# EAGLE design RGB (EAGLE 5.04)
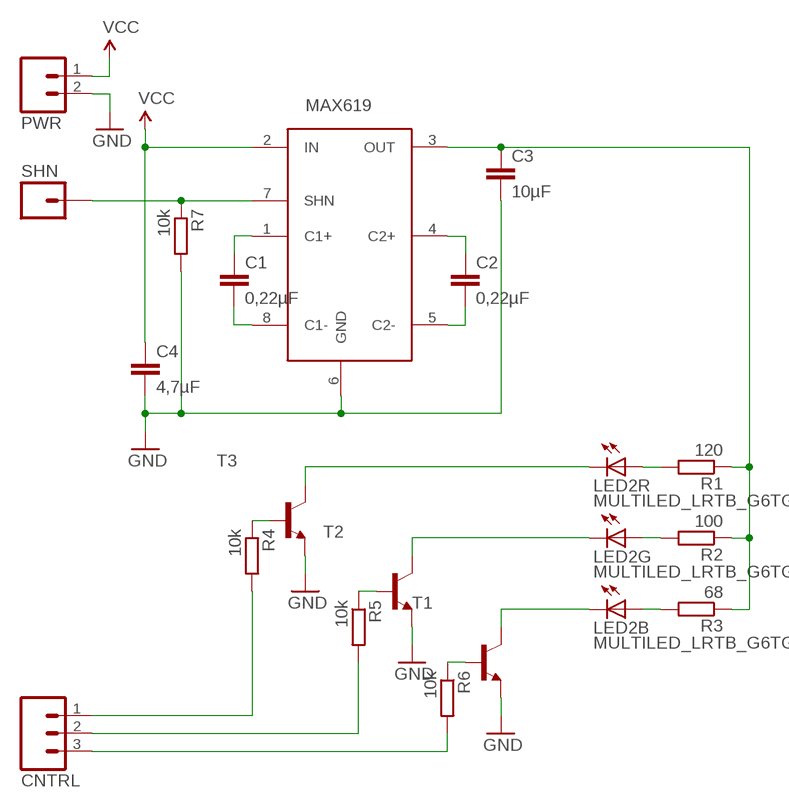
[diagram p0: schematic, sheet 1]

## Parts
C1  0,22µF  C-EUC0805  [C0805]
C2  0,22µF  C-EUC0805  [C0805]
C3  10µF  C-EUC0805  [C0805]
C4  4,7µF  C-EUC0805  [C0805]
CNTRL  M03PTH  [1X03]
IC1  MAX619SOIC8  [SO08]
LED2  MULTILED_LRTB_G6TG  [P-LCC-6_TOPLED]
PWR  M02PTH  [1X02]
R1  120  R-EU_M0805  [M0805]
R2  100  R-EU_M0805  [M0805]
R3  68  R-EU_M0805  [M0805]
R4  10k  R-EU_M0805  [M0805]
R5  10k  R-EU_M0805  [M0805]
R6  10k  R-EU_M0805  [M0805]
R7  10k  R-EU_M0805  [M0805]
SHN  M01PTH  [1X01]
T1  BC850-NPN-SOT23-BEC  [SOT23-BEC]
T2  BC850-NPN-SOT23-BEC  [SOT23-BEC]
T3  BC850-NPN-SOT23-BEC  [SOT23-BEC]

## Nets
GND: C3.2 C4.2 IC1.6(GND) PWR.2 R7.2 T1.E T2.E T3.E
N$1: LED2.C1(R:C) T3.C
N$2: C1.1 IC1.1(C1+)
N$3: C1.2 IC1.8(C1-)
N$4: C2.1 IC1.4(C2+)
N$5: C2.2 IC1.5(C2-)
N$6: LED2.A1(R:A) R1.2
N$7: C3.1 IC1.3(OUT) R1.1 R2.1 R3.1
N$8: LED2.A2(G:A) R2.2
N$9: LED2.C2(G:C) T2.C
N$10: LED2.A3(B:A) R3.2
N$11: LED2.C3(B:C) T1.C
N$12: R4.1 T3.B
N$13: R5.1 T2.B
N$14: R6.1 T1.B
N$15: CNTRL.1 R4.2
N$16: CNTRL.2 R5.2
N$17: CNTRL.3 R6.2
N$19: IC1.7(SHN) R7.1 SHN.1
VCC: C4.1 IC1.2(IN) PWR.1

## Library data of the parts
C1-C4 = rcl:C-EU: CAPACITOR, European symbol
CNTRL = SparkFun:M03: Header 3 Standard 3-pin 0.1" header. Use with straight break away headers (SKU : PRT-00116), right angle break away headers (PRT-00553), swiss pins (PRT-00743), machine pins (PRT-00117), and female headers (PRT-00115). Molex polarized connector foot print use with SKU : PRT-08232 with associated crimp pins and housings.
IC1 = maxim-10:MAX619
LED2 = led:MULTILED_LRTB_G6TG: 6-lead MULTILED® Enhanced optical Power LED (ThinFilm® / ThinGaN®) Source. OSRAM - LRTB_G6TG.pdf
PWR = SparkFun:M02: Header 2 Standard 2-pin 0.1" header. Use with straight break away headers (SKU : PRT-00116), right angle break away headers (PRT-00553), swiss pins (PRT-00743), machine pins (PRT-00117), and female headers (PRT-00115). Molex polarized connector foot print use with SKU : PRT-08233 with associated crimp pins and housings.
R1-R7 = rcl:R-EU_: RESISTOR, European symbol
SHN = SparkFun:M01: Header 1 Standard 1-pin 0.1" header. Use with straight break away headers (SKU : PRT-00116), right angle break away headers (PRT-00553), swiss pins (PRT-00743), machine pins (PRT-00117), and female headers (PRT-00115).
T1-T3 = transistor:*-NPN-: NPN Transistror BF959 corrected 2008.03.06

## Board
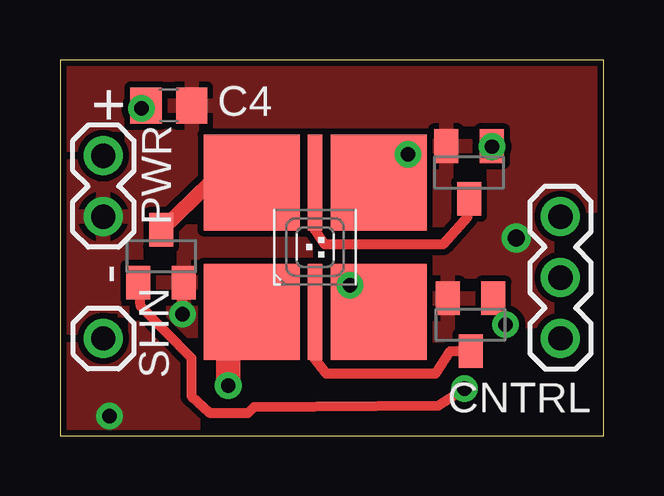
[diagram p1: board, top side]
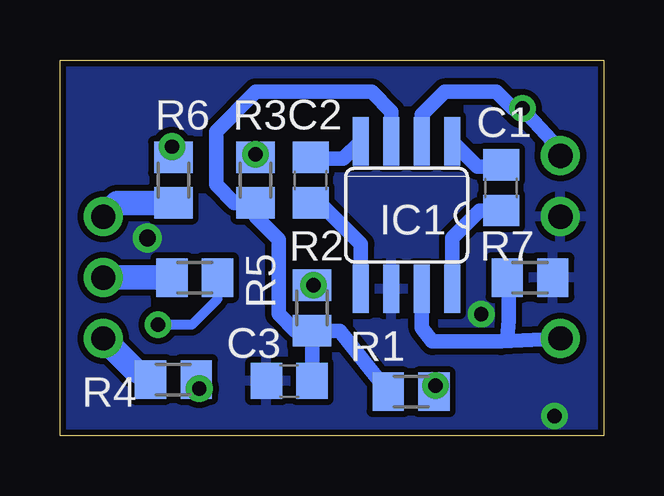
[diagram p2: board, bottom side, seen from below]

Size 22.66 x 15.67 mm. Coordinates in mm from the lower left corner, seen from the top.
Outline: 0,0 22.66,0 22.66,15.67 0,15.67 0,0
Copper layers (1*16): Top 0.035mm / dielectric 1.5mm / Bottom 0.035mm
Design rules "SparkFun.strict": minimum track width 10mil, minimum drill 20mil, track to track 10mil, track to pad 10mil, pad to pad 10mil, via to via 10mil, smd to smd 0mil, copper to edge 10mil, drill to drill 8mil, minimum pad ring 12mil, minimum via ring 10mil, stop-mask expansion 4mil, vias tented up to drill 25mil, thermal gap 10mil

### Footprints (pad centres in the part's own frame; a part is rotated, then mirrored left to right if it is on the bottom)
C0805 = smd 1.3 x 1.5: 1 -0.95,0; 2 0.95,0
1X03 = drill 1.016 round: 1 0,0; 2 2.54,0; 3 5.08,0
SO08 = smd 0.66 x 2.032: 1 -1.905,-3.073; 2 -0.635,-3.073; 3 0.635,-3.073; 4 1.905,-3.073; 5 1.905,3.073; 6 0.635,3.073; 7 -0.635,3.073; 8 -1.905,3.073
P-LCC-6_TOPLED = smd 4 x 4: A1 -2.65,-2.7; A2 2.65,-2.7; A3 2.65,2.7; C1 -2.65,2.7 | smd 0.6 x 4: C2 0,-2.7; C3 0,2.7
1X02 = drill 1.016 round: 1 0,0; 2 2.54,0
M0805 = smd 1.3 x 1.6: 1 -0.95,0; 2 0.95,0
1X01 = drill 1.016 round: 1 0,0
SOT23-BEC = smd 1 x 1.4: B -0.95,-1.1; C 0,1.1; E 0.95,-1.1

### Placement (x,y rotation side)
C1  4.28,10.35 270 bottom
C2  12.22,10.66 270 bottom
C3  13.11,2.28 180 bottom
C4  4.53,13.77 0 top
CNTRL  20.85,4.06 90 top
IC1  8.22,9.2 180 bottom
LED2  10.63,7.87 0 top
PWR  1.8,11.68 270 top
R1  8.03,1.84 0 bottom
R2  12.15,5.33 90 bottom
R3  14.5,10.66 90 bottom
R4  17.93,2.34 180 bottom
R5  17.04,6.6 180 bottom
R6  17.93,10.66 270 bottom
R7  3.07,6.6 0 bottom
SHN  1.8,4.06 0 top
T1  17.04,10.98 180 top
T2  17.11,4.63 180 top
T3  4.22,7.49 0 top

### Tracks (layer width: path | path; a pad name or v marks a point on that pad's centre or on a via)
GND  (via drill 0.6, 0.7)
  Top 0.406: T3.E 5.1,5.65 v5.11,5.08
  Bottom 0.406: v5.11,5.08 5.23,4.95 5.3,5.33
  other vias: 19.01,8.25 2.06,0.82
  pour Bottom: -2.01,33.52 -0.74,0.25 52.29,-1.08 50.51,32.13
  pour Top: -2.96,36.06 -2.01,-0.77 55.4,-3.37 52.92,36.32
N$1
  Top 0.406: 6.26,10.57 LED2.C1
  Top 0.61: T3.C 6.26,10.57
N$2
  Bottom 0.61: C1.1 4.34,11.23 5.27,11.23 IC1.1
N$3
  Bottom 0.61: C1.2 5.17,9.39 6.31,8.25 IC1.8
N$4
  Bottom 0.61: C2.1 11.9,11.55 10.85,11.55 IC1.4
N$5
  Bottom 0.61: C2.2 11.96,9.71 11.9,9.77 10.12,8 IC1.5
N$6  (via drill 0.6)
  Top 0.406: 7.01,4.2 7.98,4.2 LED2.A1
  Top 1.016: v7.01,2.09 7.01,4.2
  Bottom 0.61: R1.2 7.01,1.59 v7.01,2.09
N$7
  Bottom 0.61: R2.1 12.85,4.38 13.55,5.08 13.55,8.19 14.5,9.14 R3.1 15.4,9.71 16.15,10.47 16.15,12.69 14.5,14.35 9.68,14.35 8.85,13.52 IC1.3 | R1.1 11.01,4.38 R2.1 | R2.1 C3.1
N$8  (via drill 0.6)
  Top 0.406: 12.29,6.16 13.28,6.16 LED2.A2
  Top 0.61: v12.09,6.28 12.29,6.16
  Bottom 0.61: R2.2 11.97,6.41 v12.09,6.28
N$9
  Top 0.406: T2.C 16.26,3.53 15.65,2.6 11.07,2.6 10.63,3.17 LED2.C2
N$10  (via drill 0.6)
  Top 0.406: LED2.A3 14.5,10.57 v14.5,11.74
  Top 0.61: v14.5,11.74 14.45,11.74
  Bottom 0.61: v14.5,11.74 R3.2
N$11
  Top 0.406: T1.C 16.98,9.82 16.98,9.14 15.96,8 11.01,8 10.63,8.57 LED2.C3
N$12  (via drill 0.6)
  Top 0.406: T3.B 3.37,5.39 5.49,3.23 5.49,1.65 6.25,0.95 7.84,0.95 8.09,1.2 15.78,1.27 v16.86,1.96
  Bottom 0.406: v16.86,1.96 16.98,2.22 17.3,1.9 17.3,2.03 v16.86,1.96 | R4.1 16.98,2.22 v16.86,1.96
N$13  (via drill 0.6)
  Top 0.406: v18.57,4.63 18.19,5.6 T2.B
  Bottom 0.406: R5.1 16.09,5.71 17.17,4.63 v18.57,4.63
N$14  (via drill 0.6)
  Top 0.406: T1.B 18.29,12.25 v18,12.06
  Bottom 0.406: v18,12.06 17.55,11.61 R6.1
N$15
  Bottom 1.016: CNTRL.1 19.58,2.79 R4.2
N$16
  Bottom 1.016: R5.2 CNTRL.2
N$17
  Bottom 1.016: CNTRL.3 20.28,9.71 R6.2
N$19
  Bottom 0.61: IC1.7 7.58,4.5 7.14,3.93 4.28,3.93 | R7.1 3.96,6.6 3.96,4.82 4.03,4.06 | 4.28,3.93 4.03,4.06 | 4.03,4.06 4.09,4 4.28,3.93 | SHN.1 1.68,4.06 4.28,3.93
VCC  (via drill 0.6)
  Top 0.61: v3.39,13.65 C4.1 v3.39,13.65
  Bottom 0.61: PWR.1 1.93,12.06 v3.39,13.65 3.77,13.65 4.47,14.35 6.63,14.35 7.58,13.39 IC1.2

### Text on the board
tNames: + | -